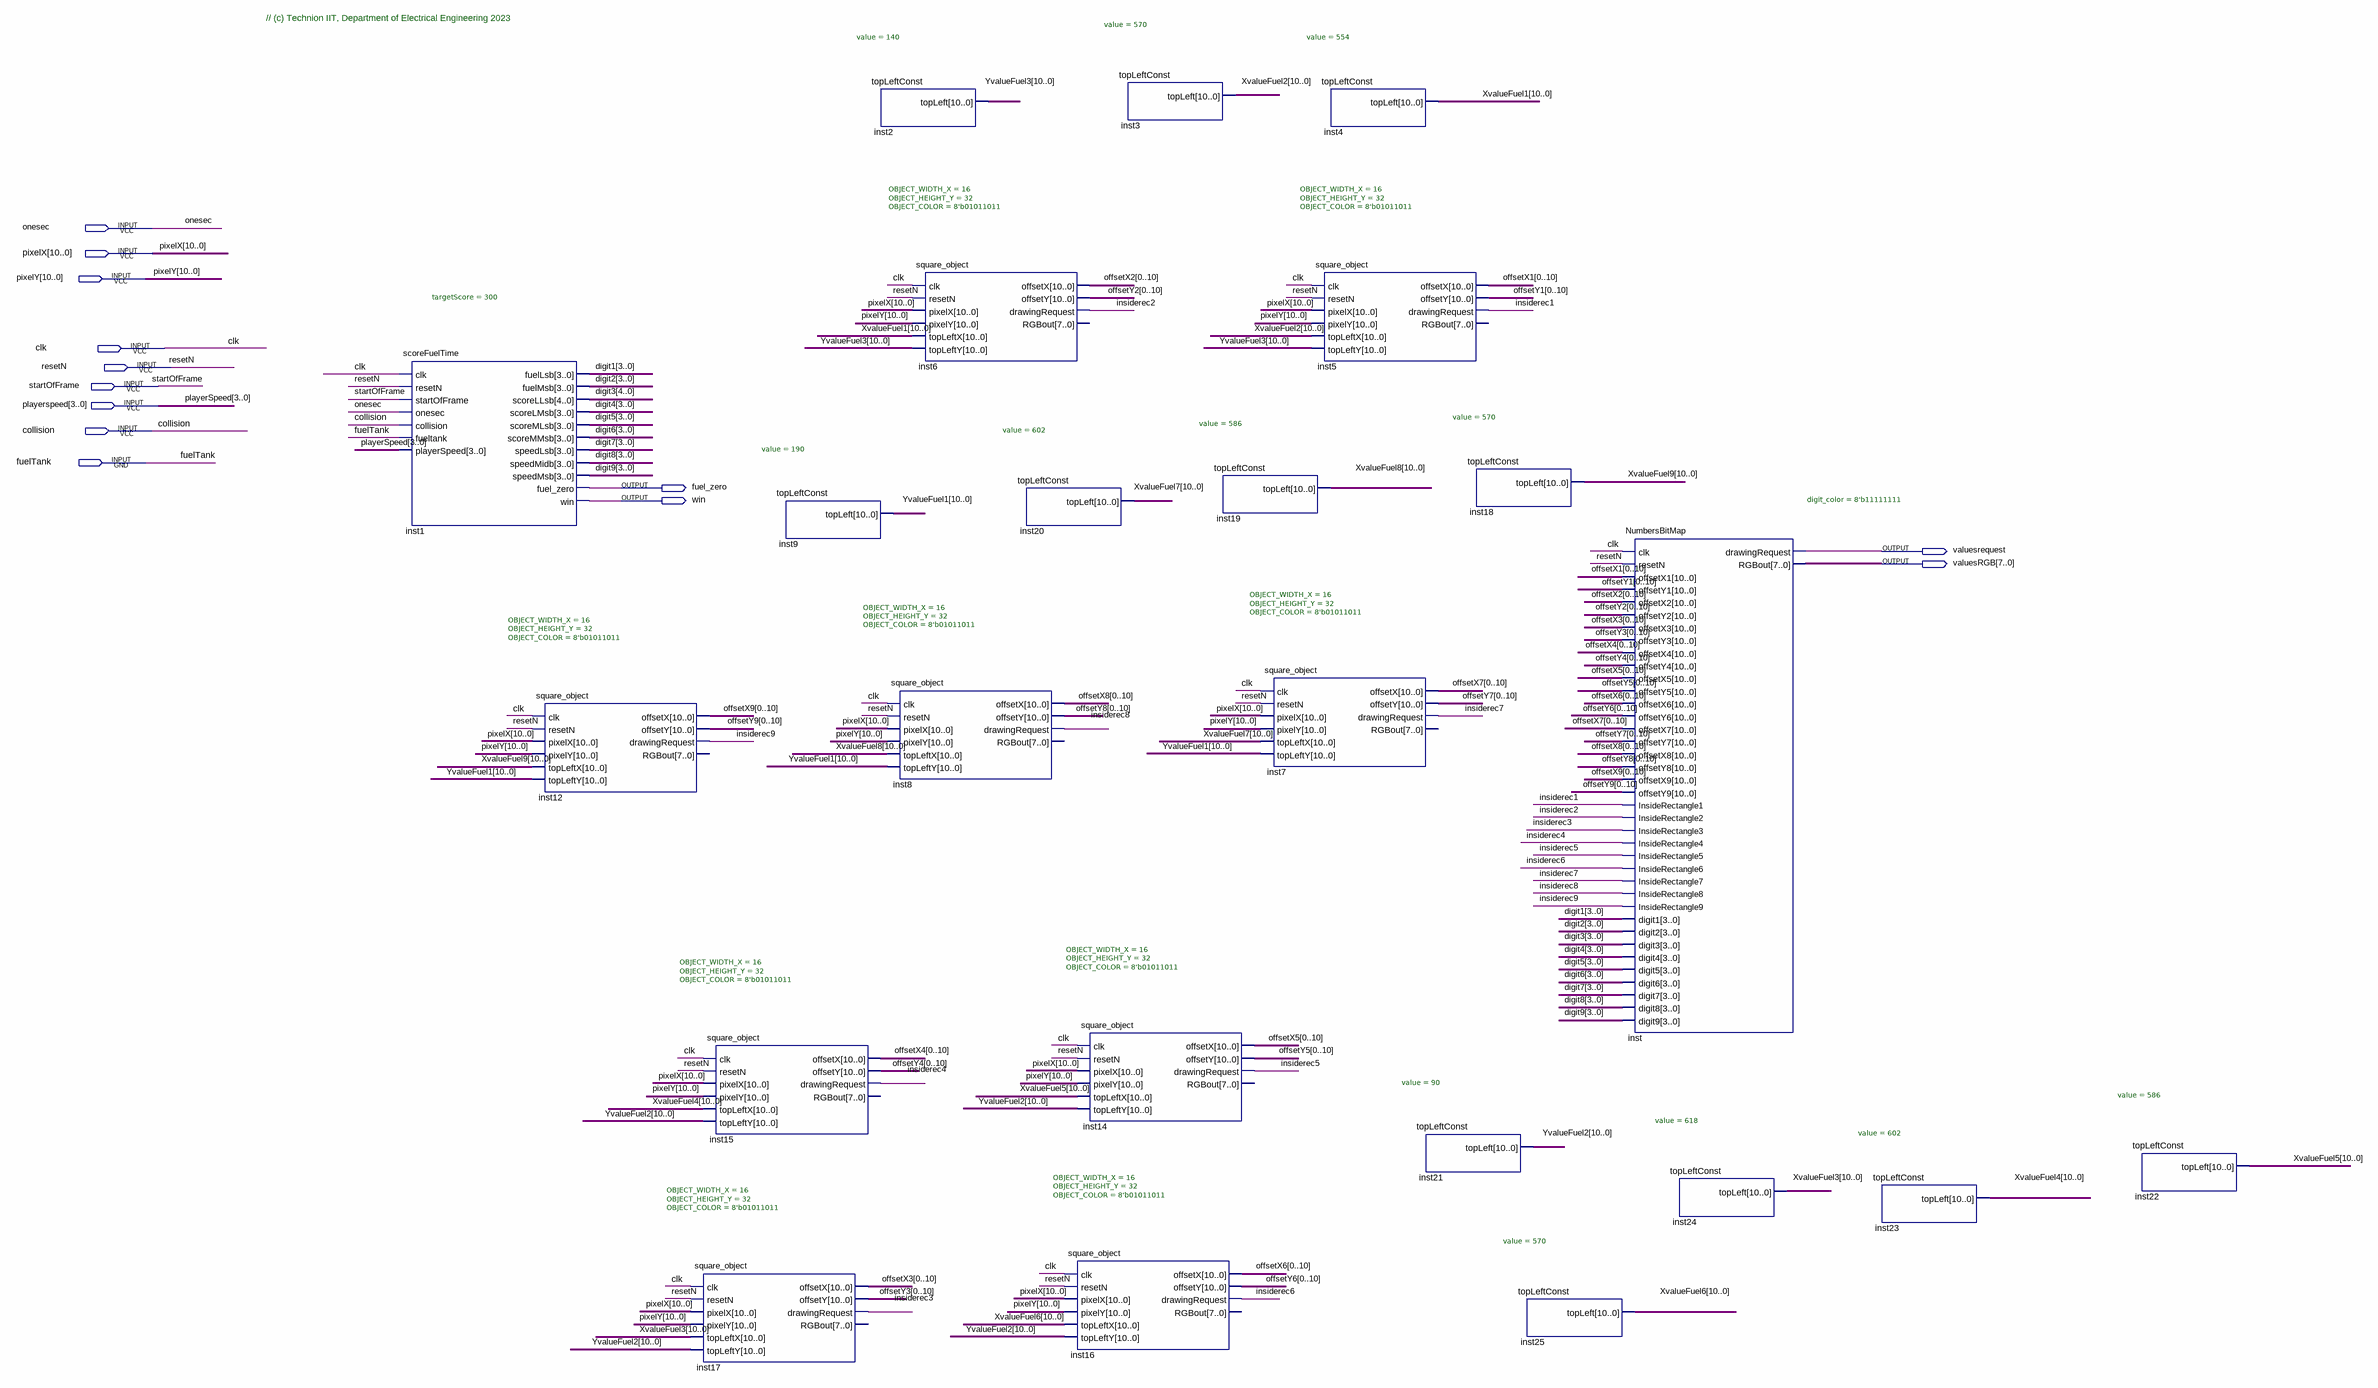
[diagram p0: schematic sheet]
// Quartus schematic valuesBlock.bdf as structural Verilog: 23 symbols, 13 pins
module valuesBlock (
  input  onesec,
  input  [10:0] pixelX,
  input  [10:0] pixelY,
  input  clk,
  input  resetN,
  input  startOfFrame,
  input  [3:0] playerspeed,
  input  collision,
  input  fuelTank,
  output fuel_zero,
  output win,
  output valuesrequest,
  output [7:0] valuesRGB
);

  wire insiderec1, insiderec2, insiderec3, insiderec4, insiderec5, insiderec6, insiderec7, insiderec8,
       insiderec9;
  wire [3:0] digit1, digit2, digit4, digit5, digit6, digit7, digit8, digit9;
  wire [4:0] digit3;
  wire [10:0] offsetX1, offsetX2, offsetX3, offsetX4, offsetX5, offsetX6, offsetX7, offsetX8, offsetX9,
       offsetY1, offsetY2, offsetY3, offsetY4, offsetY5, offsetY6, offsetY7, offsetY8, offsetY9, XvalueFuel1,
       XvalueFuel2, XvalueFuel3, XvalueFuel4, XvalueFuel5, XvalueFuel6, XvalueFuel7, XvalueFuel8,
       XvalueFuel9, YvalueFuel1, YvalueFuel2, YvalueFuel3;

  scoreFuelTime #(.targetScore(300)) inst1 (
    .clk(clk), .resetN(resetN), .startOfFrame(startOfFrame), .onesec(onesec), .collision(collision),
    .fueltank(fuelTank), .playerSpeed(playerspeed), .fuelLsb(digit1), .fuelMsb(digit2), .scoreLLsb(digit3),
    .scoreLMsb(digit4), .scoreMLsb(digit5), .scoreMMsb(digit6), .speedLsb(digit7), .speedMidb(digit8),
    .speedMsb(digit9), .fuel_zero(fuel_zero), .win(win));
  square_object #(.OBJECT_WIDTH_X(16), .OBJECT_HEIGHT_Y(32), .OBJECT_COLOR(8'b01011011)) inst12 (
    .clk(clk), .resetN(resetN), .pixelX(pixelX), .pixelY(pixelY), .topLeftX(XvalueFuel9),
    .topLeftY(YvalueFuel1),
    .offsetX({offsetX9[0], offsetX9[1], offsetX9[2], offsetX9[3], offsetX9[4], offsetX9[5], offsetX9[6], offsetX9[7], offsetX9[8], offsetX9[9], offsetX9[10]}),
    .offsetY({offsetY9[0], offsetY9[1], offsetY9[2], offsetY9[3], offsetY9[4], offsetY9[5], offsetY9[6], offsetY9[7], offsetY9[8], offsetY9[9], offsetY9[10]}),
    .drawingRequest(insiderec9));  // open: RGBout
  square_object #(.OBJECT_WIDTH_X(16), .OBJECT_HEIGHT_Y(32), .OBJECT_COLOR(8'b01011011)) inst15 (
    .clk(clk), .resetN(resetN), .pixelX(pixelX), .pixelY(pixelY), .topLeftX(XvalueFuel4),
    .topLeftY(YvalueFuel2),
    .offsetX({offsetX4[0], offsetX4[1], offsetX4[2], offsetX4[3], offsetX4[4], offsetX4[5], offsetX4[6], offsetX4[7], offsetX4[8], offsetX4[9], offsetX4[10]}),
    .offsetY({offsetY4[0], offsetY4[1], offsetY4[2], offsetY4[3], offsetY4[4], offsetY4[5], offsetY4[6], offsetY4[7], offsetY4[8], offsetY4[9], offsetY4[10]}),
    .drawingRequest(insiderec4));  // open: RGBout
  square_object #(.OBJECT_WIDTH_X(16), .OBJECT_HEIGHT_Y(32), .OBJECT_COLOR(8'b01011011)) inst17 (
    .clk(clk), .resetN(resetN), .pixelX(pixelX), .pixelY(pixelY), .topLeftX(XvalueFuel3),
    .topLeftY(YvalueFuel2),
    .offsetX({offsetX3[0], offsetX3[1], offsetX3[2], offsetX3[3], offsetX3[4], offsetX3[5], offsetX3[6], offsetX3[7], offsetX3[8], offsetX3[9], offsetX3[10]}),
    .offsetY({offsetY3[0], offsetY3[1], offsetY3[2], offsetY3[3], offsetY3[4], offsetY3[5], offsetY3[6], offsetY3[7], offsetY3[8], offsetY3[9], offsetY3[10]}),
    .drawingRequest(insiderec3));  // open: RGBout
  topLeftConst #(.value(190)) inst9 (.topLeft(YvalueFuel1));
  topLeftConst #(.value(140)) inst2 (.topLeft(YvalueFuel3));
  square_object #(.OBJECT_WIDTH_X(16), .OBJECT_HEIGHT_Y(32), .OBJECT_COLOR(8'b01011011)) inst6 (
    .clk(clk), .resetN(resetN), .pixelX(pixelX), .pixelY(pixelY), .topLeftX(XvalueFuel1),
    .topLeftY(YvalueFuel3),
    .offsetX({offsetX2[0], offsetX2[1], offsetX2[2], offsetX2[3], offsetX2[4], offsetX2[5], offsetX2[6], offsetX2[7], offsetX2[8], offsetX2[9], offsetX2[10]}),
    .offsetY({offsetY2[0], offsetY2[1], offsetY2[2], offsetY2[3], offsetY2[4], offsetY2[5], offsetY2[6], offsetY2[7], offsetY2[8], offsetY2[9], offsetY2[10]}),
    .drawingRequest(insiderec2));  // open: RGBout
  square_object #(.OBJECT_WIDTH_X(16), .OBJECT_HEIGHT_Y(32), .OBJECT_COLOR(8'b01011011)) inst8 (
    .clk(clk), .resetN(resetN), .pixelX(pixelX), .pixelY(pixelY), .topLeftX(XvalueFuel8),
    .topLeftY(YvalueFuel1),
    .offsetX({offsetX8[0], offsetX8[1], offsetX8[2], offsetX8[3], offsetX8[4], offsetX8[5], offsetX8[6], offsetX8[7], offsetX8[8], offsetX8[9], offsetX8[10]}),
    .offsetY({offsetY8[0], offsetY8[1], offsetY8[2], offsetY8[3], offsetY8[4], offsetY8[5], offsetY8[6], offsetY8[7], offsetY8[8], offsetY8[9], offsetY8[10]}),
    .drawingRequest(insiderec8));  // open: RGBout
  topLeftConst #(.value(602)) inst20 (.topLeft(XvalueFuel7));
  square_object #(.OBJECT_WIDTH_X(16), .OBJECT_HEIGHT_Y(32), .OBJECT_COLOR(8'b01011011)) inst16 (
    .clk(clk), .resetN(resetN), .pixelX(pixelX), .pixelY(pixelY), .topLeftX(XvalueFuel6),
    .topLeftY(YvalueFuel2),
    .offsetX({offsetX6[0], offsetX6[1], offsetX6[2], offsetX6[3], offsetX6[4], offsetX6[5], offsetX6[6], offsetX6[7], offsetX6[8], offsetX6[9], offsetX6[10]}),
    .offsetY({offsetY6[0], offsetY6[1], offsetY6[2], offsetY6[3], offsetY6[4], offsetY6[5], offsetY6[6], offsetY6[7], offsetY6[8], offsetY6[9], offsetY6[10]}),
    .drawingRequest(insiderec6));  // open: RGBout
  topLeftConst #(.value(570)) inst3 (.topLeft(XvalueFuel2));
  square_object #(.OBJECT_WIDTH_X(16), .OBJECT_HEIGHT_Y(32), .OBJECT_COLOR(8'b01011011)) inst14 (
    .clk(clk), .resetN(resetN), .pixelX(pixelX), .pixelY(pixelY), .topLeftX(XvalueFuel5),
    .topLeftY(YvalueFuel2),
    .offsetX({offsetX5[0], offsetX5[1], offsetX5[2], offsetX5[3], offsetX5[4], offsetX5[5], offsetX5[6], offsetX5[7], offsetX5[8], offsetX5[9], offsetX5[10]}),
    .offsetY({offsetY5[0], offsetY5[1], offsetY5[2], offsetY5[3], offsetY5[4], offsetY5[5], offsetY5[6], offsetY5[7], offsetY5[8], offsetY5[9], offsetY5[10]}),
    .drawingRequest(insiderec5));  // open: RGBout
  topLeftConst #(.value(586)) inst19 (.topLeft(XvalueFuel8));
  square_object #(.OBJECT_WIDTH_X(16), .OBJECT_HEIGHT_Y(32), .OBJECT_COLOR(8'b01011011)) inst7 (
    .clk(clk), .resetN(resetN), .pixelX(pixelX), .pixelY(pixelY), .topLeftX(XvalueFuel7),
    .topLeftY(YvalueFuel1),
    .offsetX({offsetX7[0], offsetX7[1], offsetX7[2], offsetX7[3], offsetX7[4], offsetX7[5], offsetX7[6], offsetX7[7], offsetX7[8], offsetX7[9], offsetX7[10]}),
    .offsetY({offsetY7[0], offsetY7[1], offsetY7[2], offsetY7[3], offsetY7[4], offsetY7[5], offsetY7[6], offsetY7[7], offsetY7[8], offsetY7[9], offsetY7[10]}),
    .drawingRequest(insiderec7));  // open: RGBout
  topLeftConst #(.value(554)) inst4 (.topLeft(XvalueFuel1));
  square_object #(.OBJECT_WIDTH_X(16), .OBJECT_HEIGHT_Y(32), .OBJECT_COLOR(8'b01011011)) inst5 (
    .clk(clk), .resetN(resetN), .pixelX(pixelX), .pixelY(pixelY), .topLeftX(XvalueFuel2),
    .topLeftY(YvalueFuel3),
    .offsetX({offsetX1[0], offsetX1[1], offsetX1[2], offsetX1[3], offsetX1[4], offsetX1[5], offsetX1[6], offsetX1[7], offsetX1[8], offsetX1[9], offsetX1[10]}),
    .offsetY({offsetY1[0], offsetY1[1], offsetY1[2], offsetY1[3], offsetY1[4], offsetY1[5], offsetY1[6], offsetY1[7], offsetY1[8], offsetY1[9], offsetY1[10]}),
    .drawingRequest(insiderec1));  // open: RGBout
  topLeftConst #(.value(90)) inst21 (.topLeft(YvalueFuel2));
  topLeftConst #(.value(570)) inst18 (.topLeft(XvalueFuel9));
  topLeftConst #(.value(570)) inst25 (.topLeft(XvalueFuel6));
  NumbersBitMap #(.digit_color(8'b11111111)) inst (
    .clk(clk), .resetN(resetN),
    .offsetX1({offsetX1[0], offsetX1[1], offsetX1[2], offsetX1[3], offsetX1[4], offsetX1[5], offsetX1[6], offsetX1[7], offsetX1[8], offsetX1[9], offsetX1[10]}),
    .offsetY1({offsetY1[0], offsetY1[1], offsetY1[2], offsetY1[3], offsetY1[4], offsetY1[5], offsetY1[6], offsetY1[7], offsetY1[8], offsetY1[9], offsetY1[10]}),
    .offsetX2({offsetX2[0], offsetX2[1], offsetX2[2], offsetX2[3], offsetX2[4], offsetX2[5], offsetX2[6], offsetX2[7], offsetX2[8], offsetX2[9], offsetX2[10]}),
    .offsetY2({offsetY2[0], offsetY2[1], offsetY2[2], offsetY2[3], offsetY2[4], offsetY2[5], offsetY2[6], offsetY2[7], offsetY2[8], offsetY2[9], offsetY2[10]}),
    .offsetX3({offsetX3[0], offsetX3[1], offsetX3[2], offsetX3[3], offsetX3[4], offsetX3[5], offsetX3[6], offsetX3[7], offsetX3[8], offsetX3[9], offsetX3[10]}),
    .offsetY3({offsetY3[0], offsetY3[1], offsetY3[2], offsetY3[3], offsetY3[4], offsetY3[5], offsetY3[6], offsetY3[7], offsetY3[8], offsetY3[9], offsetY3[10]}),
    .offsetX4({offsetX4[0], offsetX4[1], offsetX4[2], offsetX4[3], offsetX4[4], offsetX4[5], offsetX4[6], offsetX4[7], offsetX4[8], offsetX4[9], offsetX4[10]}),
    .offsetY4({offsetY4[0], offsetY4[1], offsetY4[2], offsetY4[3], offsetY4[4], offsetY4[5], offsetY4[6], offsetY4[7], offsetY4[8], offsetY4[9], offsetY4[10]}),
    .offsetX5({offsetX5[0], offsetX5[1], offsetX5[2], offsetX5[3], offsetX5[4], offsetX5[5], offsetX5[6], offsetX5[7], offsetX5[8], offsetX5[9], offsetX5[10]}),
    .offsetY5({offsetY5[0], offsetY5[1], offsetY5[2], offsetY5[3], offsetY5[4], offsetY5[5], offsetY5[6], offsetY5[7], offsetY5[8], offsetY5[9], offsetY5[10]}),
    .offsetX6({offsetX6[0], offsetX6[1], offsetX6[2], offsetX6[3], offsetX6[4], offsetX6[5], offsetX6[6], offsetX6[7], offsetX6[8], offsetX6[9], offsetX6[10]}),
    .offsetY6({offsetY6[0], offsetY6[1], offsetY6[2], offsetY6[3], offsetY6[4], offsetY6[5], offsetY6[6], offsetY6[7], offsetY6[8], offsetY6[9], offsetY6[10]}),
    .offsetX7({offsetX7[0], offsetX7[1], offsetX7[2], offsetX7[3], offsetX7[4], offsetX7[5], offsetX7[6], offsetX7[7], offsetX7[8], offsetX7[9], offsetX7[10]}),
    .offsetY7({offsetY7[0], offsetY7[1], offsetY7[2], offsetY7[3], offsetY7[4], offsetY7[5], offsetY7[6], offsetY7[7], offsetY7[8], offsetY7[9], offsetY7[10]}),
    .offsetX8({offsetX8[0], offsetX8[1], offsetX8[2], offsetX8[3], offsetX8[4], offsetX8[5], offsetX8[6], offsetX8[7], offsetX8[8], offsetX8[9], offsetX8[10]}),
    .offsetY8({offsetY8[0], offsetY8[1], offsetY8[2], offsetY8[3], offsetY8[4], offsetY8[5], offsetY8[6], offsetY8[7], offsetY8[8], offsetY8[9], offsetY8[10]}),
    .offsetX9({offsetX9[0], offsetX9[1], offsetX9[2], offsetX9[3], offsetX9[4], offsetX9[5], offsetX9[6], offsetX9[7], offsetX9[8], offsetX9[9], offsetX9[10]}),
    .offsetY9({offsetY9[0], offsetY9[1], offsetY9[2], offsetY9[3], offsetY9[4], offsetY9[5], offsetY9[6], offsetY9[7], offsetY9[8], offsetY9[9], offsetY9[10]}),
    .InsideRectangle1(insiderec1), .InsideRectangle2(insiderec2), .InsideRectangle3(insiderec3),
    .InsideRectangle4(insiderec4), .InsideRectangle5(insiderec5), .InsideRectangle6(insiderec6),
    .InsideRectangle7(insiderec7), .InsideRectangle8(insiderec8), .InsideRectangle9(insiderec9),
    .digit1(digit1), .digit2(digit2), .digit3(digit3[3:0]), .digit4(digit4), .digit5(digit5),
    .digit6(digit6), .digit7(digit7), .digit8(digit8), .digit9(digit9), .drawingRequest(valuesrequest),
    .RGBout(valuesRGB));
  topLeftConst #(.value(618)) inst24 (.topLeft(XvalueFuel3));
  topLeftConst #(.value(602)) inst23 (.topLeft(XvalueFuel4));
  topLeftConst #(.value(586)) inst22 (.topLeft(XvalueFuel5));

  // Notes on the sheet:
  //   // (c) Technion IIT, Department of Electrical Engineering 2023
endmodule
